# EasyEDA schematic 1-Schematic_SmartWatch.json

## Sheets
1 Main: TITLE: Mabez Watch; REV: 0.1; Date: 2018-08-01; Sheet: 1/2; Drawn By: Scott Mabin
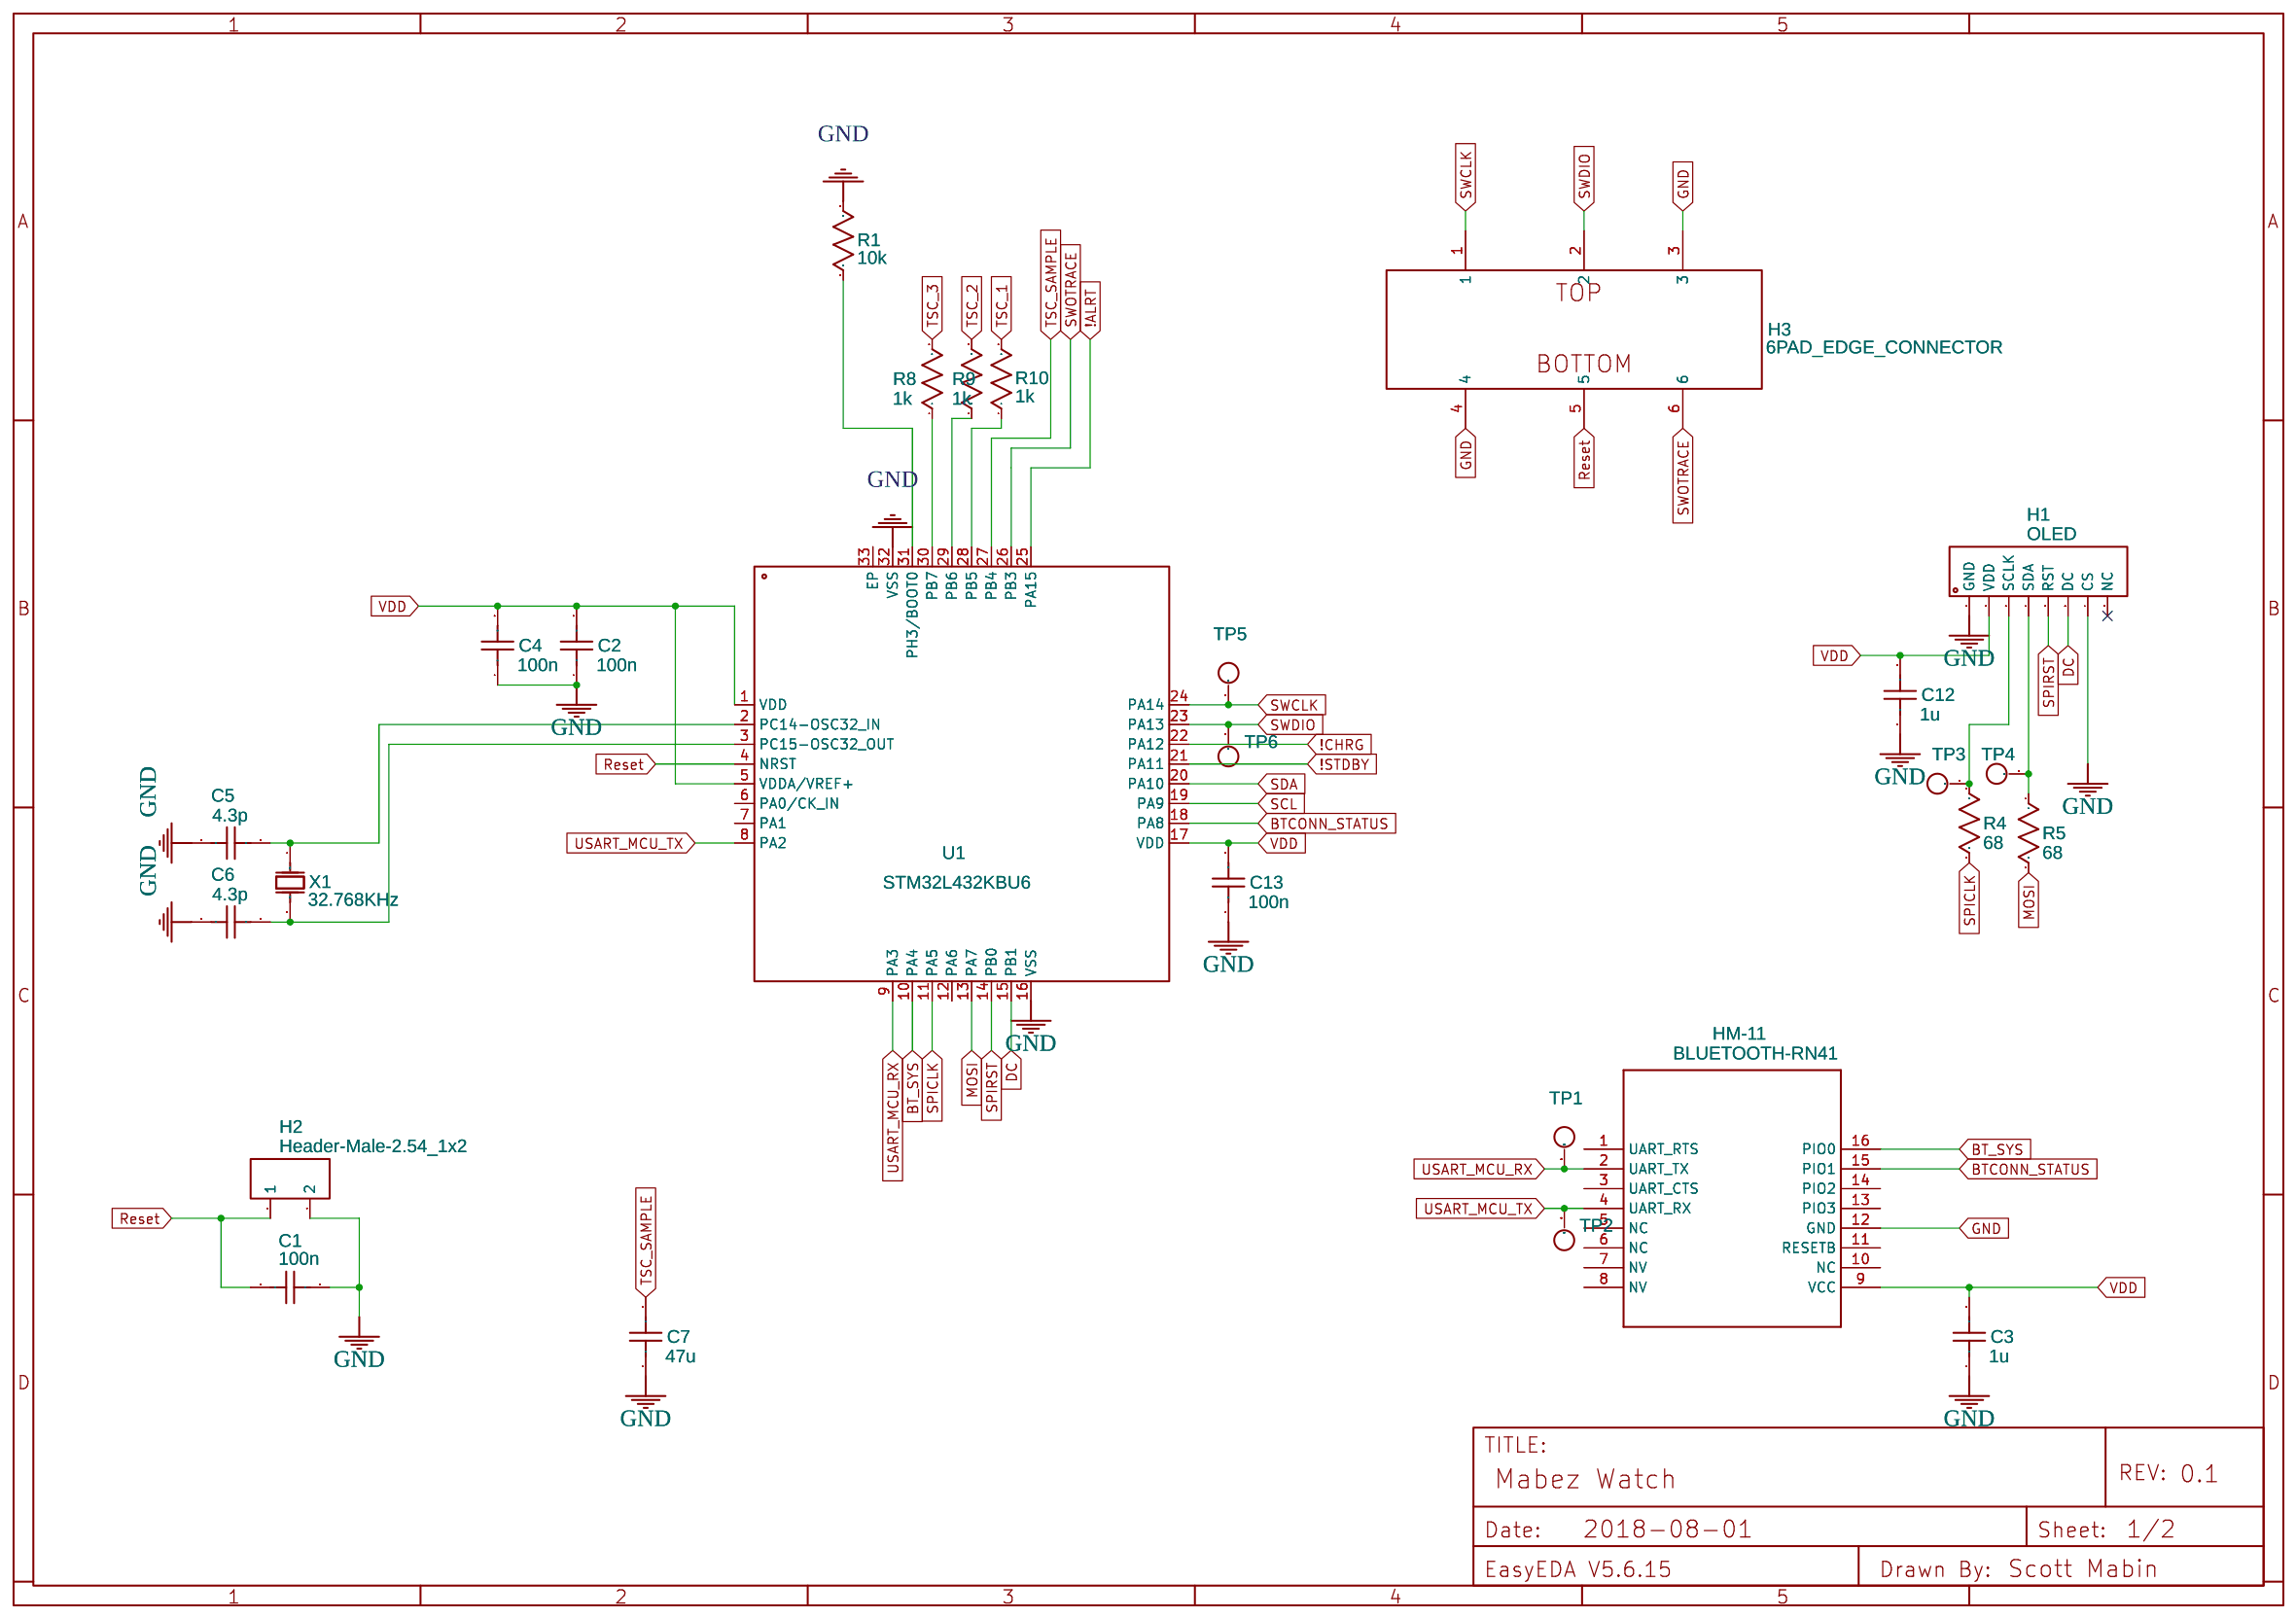
[diagram p0: Main]
2 Power & BMS: TITLE: Power & BMS; REV: 1.0; Date: 2018-10-23; Sheet: 2/2
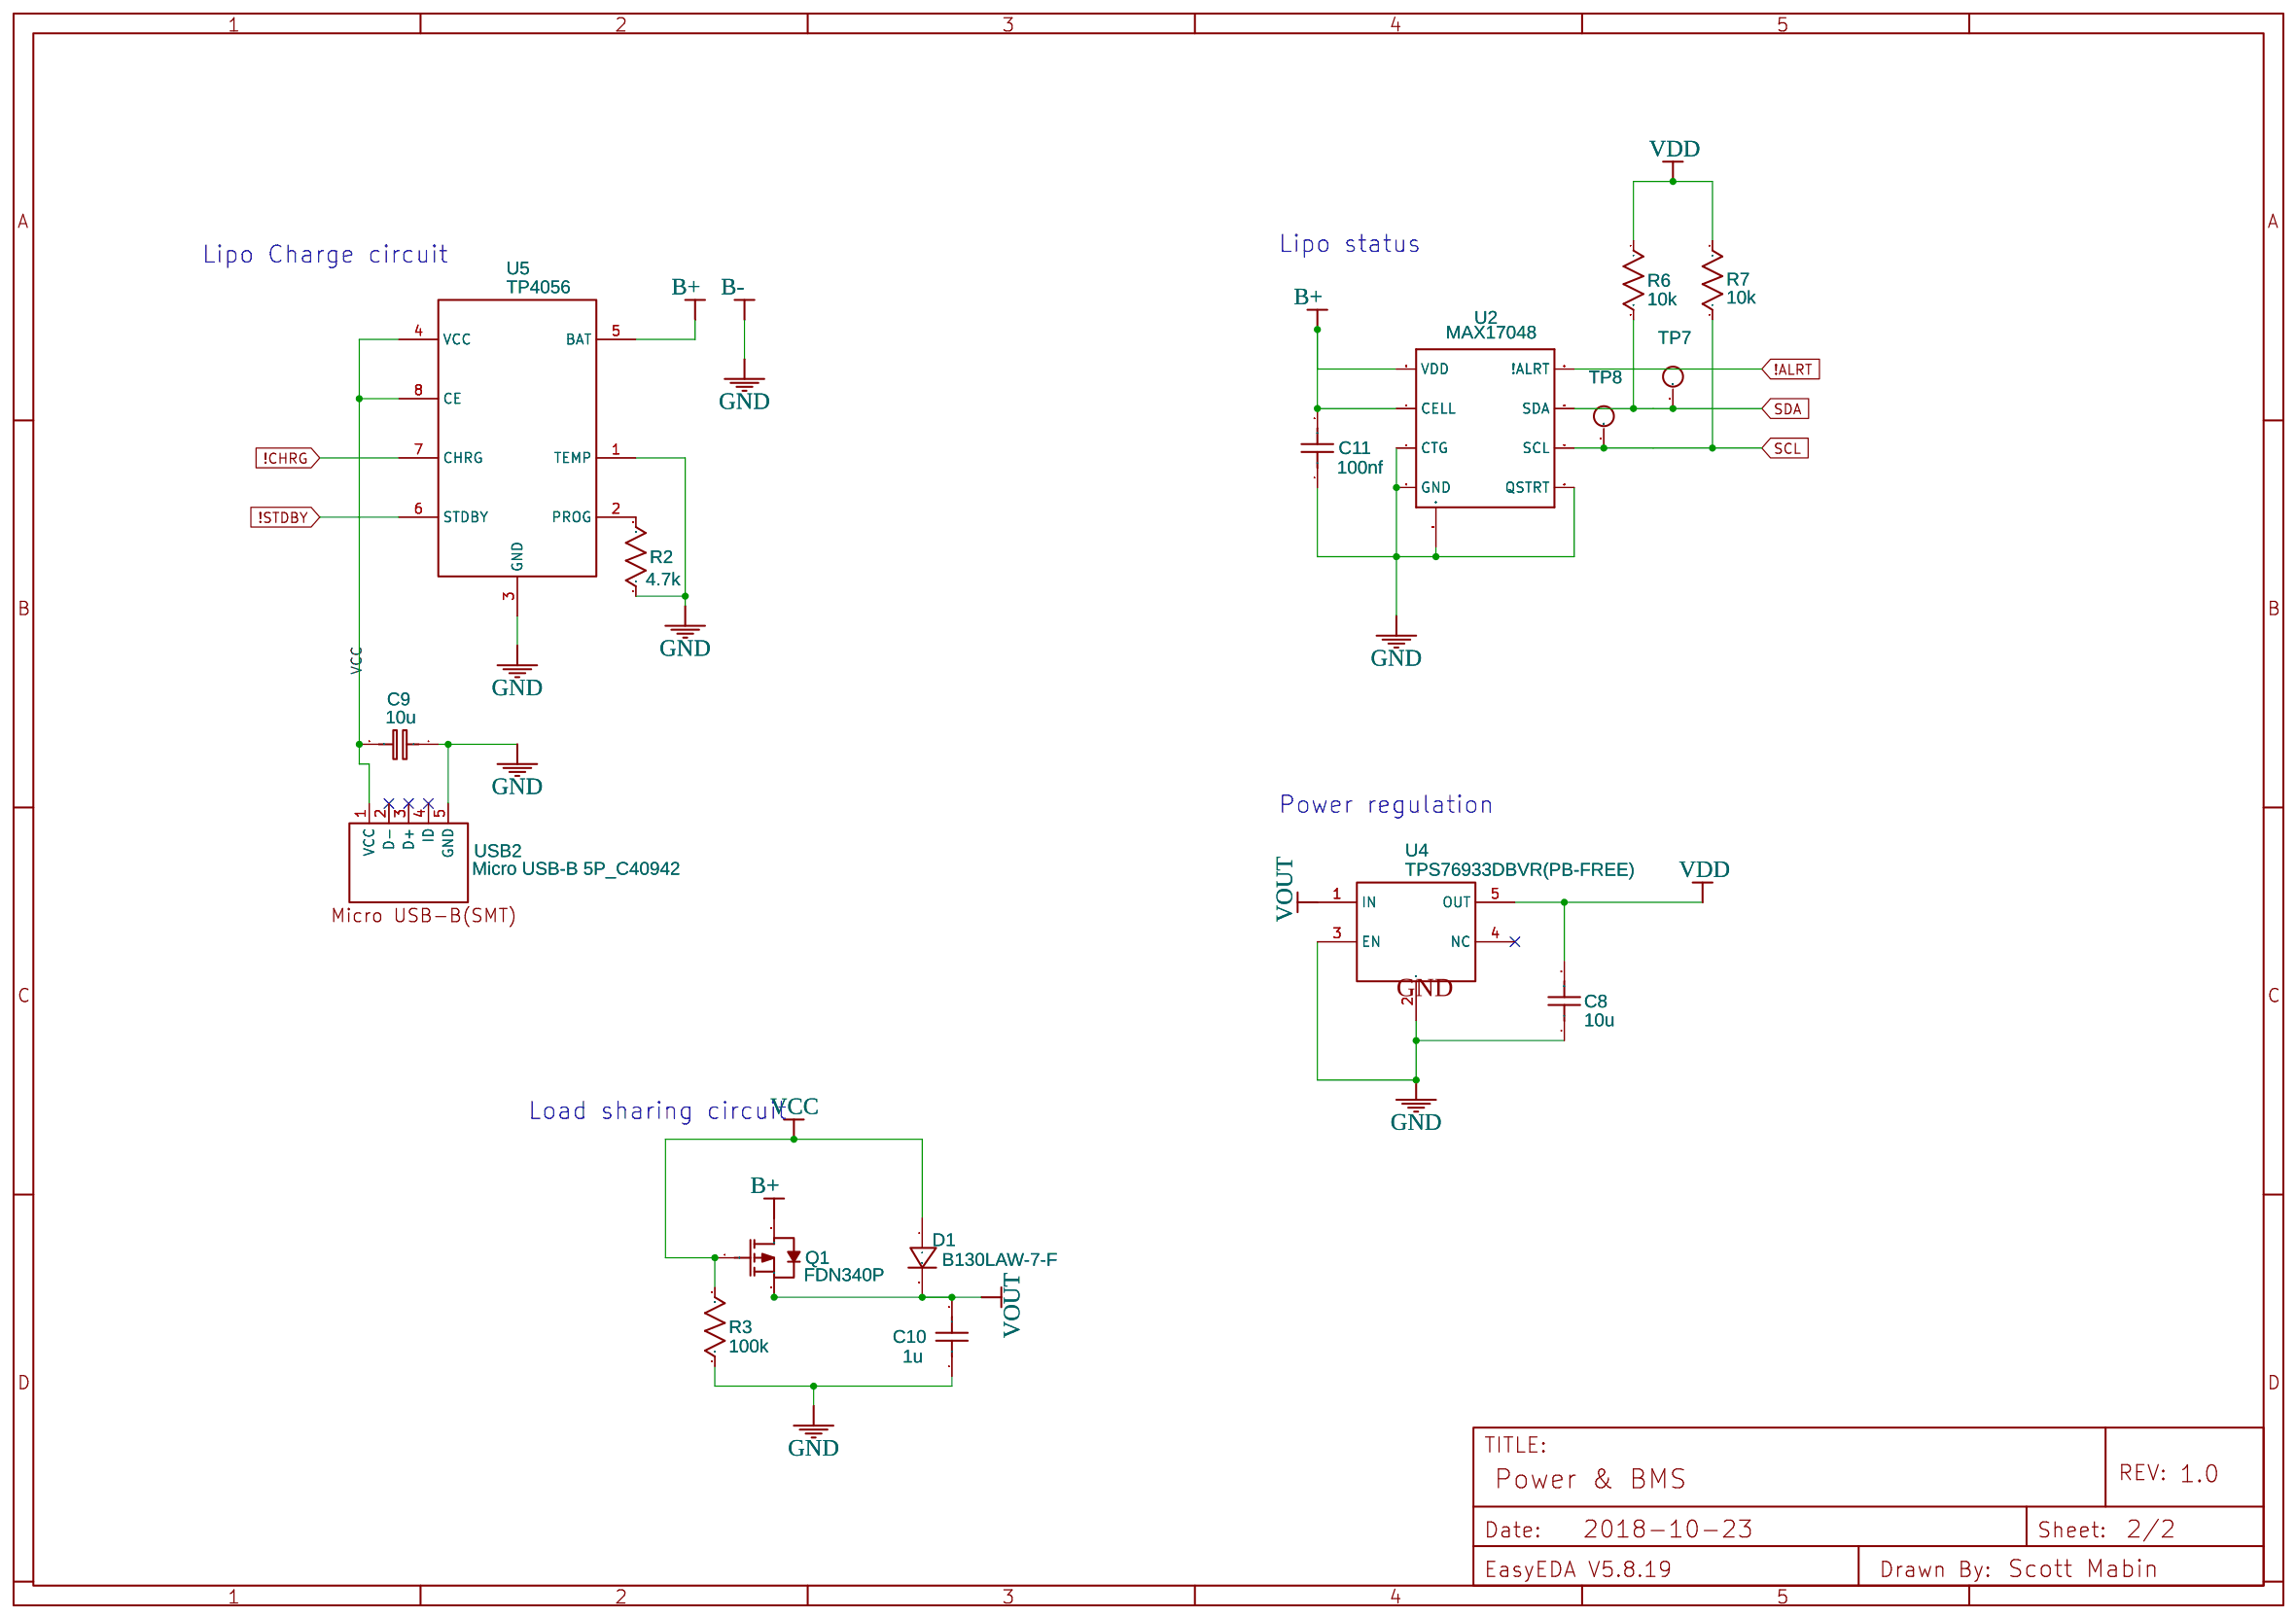
[diagram p1: Power & BMS]

## Parts
sheet Main
C1  100n  [0603]
C2  100n  [0603]
C3  1u  [0603]
C4  100n  [0603]
C5  4.3p  [0603]
C6  4.3p  [0603]
C7  47u  [0603]
C12  1u  [0603]
C13  100n  [0603]
H1  OLED  [HDR-7X1/2.54]
H2  Header-Male-2.54_1x2  [HDR-2X1/2.54]
H3  6PAD_EDGE_CONNECTOR  [6PAD_EDGE_CONNECTOR_OUTLINE_RIGHT]
HM-11  BLUETOOTH-RN41  [HM11 FOOTPRINT]
R1  10k  [0603]
R4  68  [0603]
R5  68  [0603]
R8  1k  [0603]
R9  1k  [0603]
R10  1k  [0603]
TP1  TESTPOINTROUND0.5MM  [TESTPOINT_ROUND_0.5MM]
TP2  TESTPOINTROUND0.5MM  [TESTPOINT_ROUND_0.5MM]
TP3  TESTPOINTROUND0.5MM  [TESTPOINT_ROUND_0.5MM]
TP4  TESTPOINTROUND0.5MM  [TESTPOINT_ROUND_0.5MM]
TP5  TESTPOINTROUND0.5MM  [TESTPOINT_ROUND_0.5MM]
TP6  TESTPOINTROUND0.5MM  [TESTPOINT_ROUND_0.5MM]
U1  STM32L432KBU6  [UFQFPN32-EP]
X1  32.768KHz  [SMD-3215_2P]
sheet Power & BMS
C8  10u  [0603]
C9  10u  [0603]
C10  1u  [0603]
C11  100nf  [0603]
D1  B130LAW-7-F  [SOD-123]
Q1  FDN340P  [SOT-23(SOT-23-3)]
R2  4.7k  [0603]
R3  100k  [0603]
R6  10k  [0603]
R7  10k  [0603]
TP7  TESTPOINTROUND0.5MM  [TESTPOINT_ROUND_0.5MM]
TP8  TESTPOINTROUND0.5MM  [TESTPOINT_ROUND_0.5MM]
U2  MAX17048  [DFN-8]
U4  TPS76933DBVR(PB-FREE)  [SOT-23-5]
U5  TP4056  [SOP-8_EP_150MIL]
USB2  Micro USB-B 5P_C40942  [MICRO-USB-12]

## Library data of the parts
C1 C2 C4 C11 C13 = Cap_0603_US: Manufacturer Part: 0603B104K101; Supplier: LCSC; Manufacturer: WTC; Supplier Part: C116838
C3 C10 C12 = Cap_0603_US: Manufacturer Part: 0603B105K160; Supplier: LCSC; Manufacturer: WTC; Supplier Part: C108463
C5 C6 = Cap_0603_US: Manufacturer Part: 0603N4R3B500; Supplier: LCSC; Manufacturer: WTC; Supplier Part: C123576
C7 = Cap_0603_US: Manufacturer Part: 0603X476M6R3NT; Supplier: LCSC; Manufacturer: FH; Supplier Part: C178330
H1 = -: Supplier: LCSC; Manufacturer: Ckmtw; Manufacturer Part: 210S-1*8P L=11.6MMGold-plated black; Contributor: LCSC; Supplier Part: C124381
H2 = -: Supplier Part: C86471; Supplier: LCSC; Manufacturer: TE Connectivity; Manufacturer Part: 826629-2; image: //image.lceda.cn/szlcsc/C86471.jpg
H3 = -: Manufacturer Part: ?; Supplier Part: undefined; Contributor: Scott Mabin
HM-11 = -: Contributor: SparkFun; Manufacturer Part: ?
R1 = Res_0603(1/10W)_US: Manufacturer Part: RN731JTTD1002B25; Supplier: LCSC; Manufacturer: KOA; Supplier Part: C130230
R4 R5 = Res_0603(1/10W)_US: Manufacturer Part: RCT0368RFLF; Supplier: LCSC; Manufacturer: HKR; Supplier Part: C177541
R8-R10 = Res_0603(1/10W)_US: Manufacturer Part: WR06X102JTL; Supplier: LCSC; Manufacturer: WALSIN; Supplier Part: C163868
TP1-TP8 = -: Contributor: saiko; Manufacturer Part: ?
U1 = -: Supplier: LCSC; Manufacturer: STMicroelectronics; Supplier Part: undefined
X1 = NX3215SA 32.768KHZ 12.5PF 20PPM: Supplier: LCSC; Manufacturer: NDK; Contributor: LCSC; Supplier Part: C70509
C8 = Cap_0603_US: Manufacturer Part: CL10A106MP8NNNC; Supplier: LCSC; Manufacturer: SAMSUNG; Supplier Part: C85713
C9 = Cap_RAD-0.1_EU: Manufacturer Part: CL10A106MP8NNNC; Supplier: LCSC; Manufacturer: SAMSUNG; Supplier Part: C85713
D1 = -: Supplier: LCSC; Manufacturer: DIODES; Contributor: LCSC; Supplier Part: C129191
Q1 = -: Supplier: LCSC; Manufacturer: FAIRCHILD; Contributor: LCSC; Supplier Part: C75469
R2 = Res_0603(1/10W)_US: Manufacturer Part: RS-03K4701FT; Supplier: LCSC; Manufacturer: FH; Supplier Part: C116693
R3 = Res_0603(1/10W)_US: Manufacturer Part: TC0325F1003T5E; Supplier: LCSC; Manufacturer: UniOhm; Supplier Part: C133733
R6 R7 = Res_0603(1/10W)_US: Manufacturer Part: RK73B1JTTD103J; Supplier: LCSC; Manufacturer: KOA; Supplier Part: C159891
U2 = -: Micropower 1-Cell Li+ ModelGauge; Manufacturer Part: ?
U4 = -: Supplier: LCSC; Manufacturer: TI; image: //image.lceda.cn/szlcsc/C7101.jpg; Contributor: LCSC; Supplier Part: C7101
U5 = -: Contributor: LCSC; Supplier: LCSC; Manufacturer: TOPPOWER; LCSC Assembly: Yes; image: //image.lceda.cn/szlcsc/C16581.jpg; Supplier Part: C16581
USB2 = -: Supplier: LCSC; Manufacturer: ValuePro; image: //image.lceda.cn/szlcsc/C40942.jpg; Contributor: LCSC; Supplier Part: C40942

## Nets
VCC: C9.2 D1.1 Q1.1(G) R3.2 U5.4(VCC) U5.8(CE) USB2.1(VCC)
VDD: C2.2 C3.2 C4.2 C8.2 C12.2 C13.2 H1.2(VDD) HM-11.9(VCC) R6.1 R7.2 U1.1(VDD) U1.5(VDDA/VREF+) U1.17(VDD) U4.5(OUT)
!ALRT: U1.25(PA15) U2.P$5(!ALRT)
!CHRG: U1.22(PA12) U5.7(CHRG)
!STDBY: U1.21(PA11) U5.6(STDBY)
B+: C11.2 Q1.3(D) U2.P$2(CELL) U2.P$3(VDD) U5.5(BAT)
B-: C1.1 C2.1 C3.1 C4.1 C5.1 C6.1 C7.1 C8.1 C9.1 C10.1 C11.1 C12.1 C13.1 H1.1(GND) H1.7(CS) H2.2 H3.3 H3.4 HM-11.12(GND) R1.2 R2.1 R3.1 U1.16(VSS) U1.32(VSS) U2.P$1(CTG) U2.P$4(GND) U2.P$6(QSTRT) U2.P$9(GND) U4.2(GND) U4.3(EN) U5.1(TEMP) U5.3(GND) USB2.5(GND)
BT_SYS: HM-11.16(PIO0) U1.10(PA4)
BTCONN_STATUS: HM-11.15(PIO1) U1.18(PA8)
DC: H1.6(DC) U1.15(PB1)
MOSI: R5.2 U1.13(PA7)
Reset: C1.2 H2.1 H3.5 U1.4(NRST)
SCL: R7.1 TP8.P$1 U1.19(PA9) U2.P$7(SCL)
SDA: R6.2 TP7.P$1 U1.20(PA10) U2.P$8(SDA)
SPICLK: R4.2 U1.11(PA5)
SPIRST: H1.5(RST) U1.14(PB0)
SWCLK: H3.1 TP5.P$1 U1.24(PA14)
SWDIO: H3.2 TP6.P$1 U1.23(PA13)
SWOTRACE: H3.6 U1.26(PB3)
TSC_1: R10.2
TSC_2: R9.2
TSC_3: R8.2
TSC_SAMPLE: C7.2 U1.27(PB4)
USART_MCU_RX: HM-11.2(UART_TX) TP1.P$1 U1.9(PA3)
USART_MCU_TX: HM-11.4(UART_RX) TP2.P$1 U1.8(PA2)
VOUT: C10.2 D1.2 Q1.2(S) U4.1(IN)
H1_3: H1.3(SCLK) R4.1 TP3.P$1
H1_4: H1.4(SDA) R5.1 TP4.P$1
U1_2: C5.2 U1.2(PC14-OSC32_IN) X1.1(OSC1)
U1_3: C6.2 U1.3(PC15-OSC32_OUT) X1.2(OSC2)
U1_28: R10.1 U1.28(PB5)
U1_29: R9.1 U1.29(PB6)
U1_30: R8.1 U1.30(PB7)
U1_31: R1.1 U1.31(PH3/BOOT0)
U5_2: R2.2 U5.2(PROG)

Not connected (* = marked no-connect by the designer): H1 8(NC)*; HM-11 1(UART_RTS) 3(UART_CTS) 5(NC) 6(NC) 7(NV) 8(NV) 10(NC) 11(RESETB) 13(PIO3) 14(PIO2); U1 6(PA0/CK_IN) 7(PA1) 12(PA6) 33(EP); U4 4(NC)*; USB2 2(D-)* 3(D+)* 4(ID)*

## Notes on the sheets
sheet 2
- Lipo Charge circuit
- Lipo status
- Power regulation
- Load sharing circuit
